# Altium schematic sheet LoRa.SchDoc
size A4
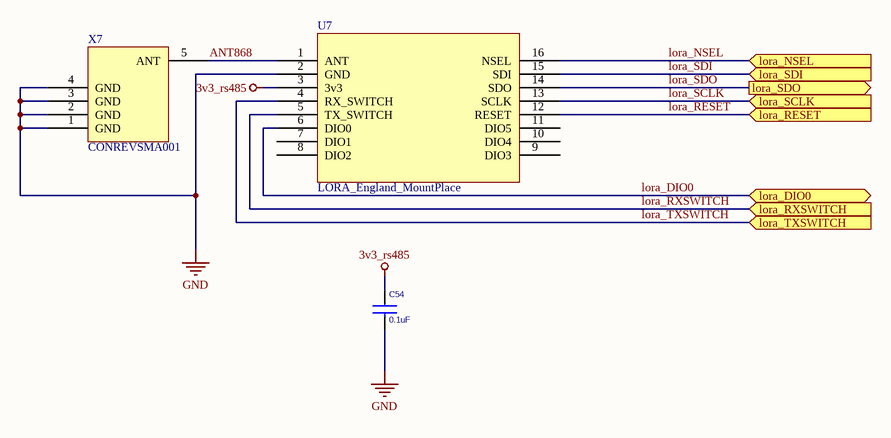
[diagram p0: LoRa.SchDoc]

## Parts
C54  0.1uF  [CAPC2012X09M]
U7  LORA_England_MountPlace  [DIP16]
X7  CONREVSMA001  [SMA6252A2-3GT50G-50]

## Ports
lora_DIO0 (bidir), lora_NSEL (in), lora_RESET (in), lora_RXSWITCH (in), lora_SCLK (in), lora_SDI (in), lora_SDO (out), lora_TXSWITCH (in)

## Nets
3v3_rs485: C54.1 U7.3(3v3)
GND: C54.2 U7.2(GND) X7.1(GND) X7.2(GND) X7.3(GND) X7.4(GND)
ANT868: U7.1(ANT) X7.5(ANT)
lora_DIO0: U7.6(DIO0) ; port lora_DIO0
lora_NSEL: U7.16(NSEL) ; port lora_NSEL
lora_RESET: U7.12(RESET) ; port lora_RESET
lora_RXSWITCH: U7.5(TX_SWITCH) ; port lora_RXSWITCH
lora_SCLK: U7.13(SCLK) ; port lora_SCLK
lora_SDI: U7.15(SDI) ; port lora_SDI
lora_SDO: U7.14(SDO) ; port lora_SDO
lora_TXSWITCH: U7.4(RX_SWITCH) ; port lora_TXSWITCH

Not connected (* = marked no-connect by the designer): U7 7(DIO1) 8(DIO2) 9(DIO3) 10(DIO4) 11(DIO5)

## Library data of the parts
C54 = CAP_SMD_0.1UF_10%: CAP CER 0.1UF 25V 10% X7R 0805; Value: 0.1uF; Supplier 1: Digi-Key; Supplier Part Number 1: 399-1168-6-ND
U7 = LORA_MODULE_E: Supplier 1: Digi-key; Supplier Part Number 1: S7050-ND
X7 = SMA_CONN: Supplier 1: Digi-key; Supplier Part Number 1: CONREVSMA001-ND